# Altium schematic sheet SCE.SchDoc
size A4
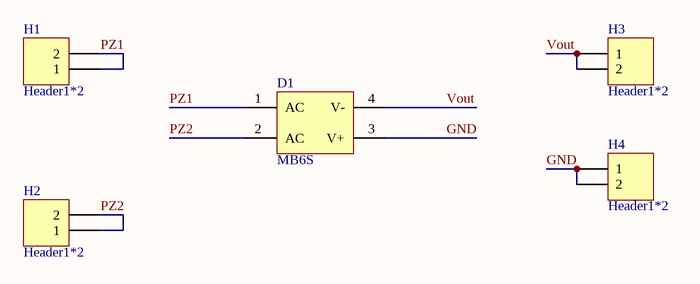
[diagram p0: SCE.SchDoc]

## Parts
D1  MB6S  [MB6S]
H1  Header1*2  [HDR1X2]
H2  Header1*2  [HDR1X2]
H3  Header1*2  [HDR1X2]
H4  Header1*2  [HDR1X2]

## Nets
GND: D1.3(V+) H4.1 H4.2
PZ1: D1.1(AC) H1.1 H1.2
PZ2: D1.2(AC) H2.1 H2.2
Vout: D1.4(V-) H3.1 H3.2

## Library data of the parts
D1 = MB6S: Diode Bridge; Published: 24-Mar-1999; LatestRevisionDate: 17-Jul-2002; LatestRevisionNote: Re-released for DXP Platform.; PackageReference: D-46_6A; Publisher: Altium Limited; PackageDescription: Bridge Rectifier; 4 Terminals; Body 16.8 x 16.8 mm (typ); Pitch 10.67 mm